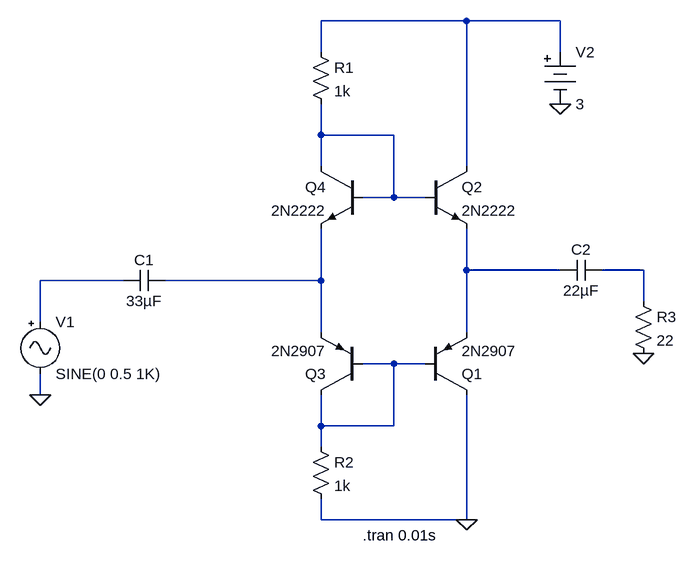
[diagram p0: schematic PowerAmp1.asc]
PowerAmp1.asc, the LTspice schematic file:
Version 4
SHEET 1 880 680
WIRE 96 -144 -128 -144
WIRE 240 -144 96 -144
WIRE -128 -96 -128 -144
WIRE 240 -96 240 -144
WIRE -128 32 -128 -16
WIRE -16 32 -128 32
WIRE -128 80 -128 32
WIRE 96 80 96 -144
WIRE -16 128 -16 32
WIRE -16 128 -64 128
WIRE 32 128 -16 128
WIRE 96 240 96 176
WIRE 240 240 96 240
WIRE 368 240 304 240
WIRE -432 256 -560 256
WIRE -128 256 -128 176
WIRE -128 256 -368 256
WIRE 368 288 368 240
WIRE -560 320 -560 256
WIRE -128 336 -128 256
WIRE 96 336 96 240
WIRE -16 384 -64 384
WIRE 32 384 -16 384
WIRE -560 432 -560 400
WIRE -128 480 -128 432
WIRE -16 480 -16 384
WIRE -16 480 -128 480
WIRE -128 512 -128 480
WIRE -128 624 -128 592
WIRE 96 624 96 432
WIRE 96 624 -128 624
FLAG 240 -16 0
FLAG -560 432 0
FLAG 368 368 0
FLAG 96 624 0
SYMBOL pnp 32 432 M180
SYMATTR InstName Q1
SYMATTR Value 2N2907
SYMBOL npn 32 80 R0
SYMATTR InstName Q2
SYMATTR Value 2N2222
SYMBOL signal -560 304 R0
SYMATTR InstName V1
SYMATTR Value SINE(0 0.5 1K)
SYMBOL battery 240 -112 R0
SYMATTR InstName V2
SYMATTR Value 3
SYMBOL pnp -64 432 R180
SYMATTR InstName Q3
SYMATTR Value 2N2907
SYMBOL npn -64 80 M0
SYMATTR InstName Q4
SYMATTR Value 2N2222
SYMBOL res -144 -112 R0
SYMATTR InstName R1
SYMATTR Value 1k
SYMBOL res -144 496 R0
SYMATTR InstName R2
SYMATTR Value 1k
SYMBOL res 352 272 R0
SYMATTR InstName R3
SYMATTR Value 22
SYMBOL cap -368 240 R90
WINDOW 0 0 32 VBottom 2
WINDOW 3 32 32 VTop 2
SYMATTR InstName C1
SYMATTR Value 33µF
SYMBOL cap 304 224 R90
WINDOW 0 0 32 VBottom 2
WINDOW 3 32 32 VTop 2
SYMATTR InstName C2
SYMATTR Value 22µF
TEXT -64 648 Left 2 !.tran 0.01s

The netlist it stands for:
* PowerAmp1.asc
Q1 0 N007 N003 0 2N2907
Q2 N001 N002 N003 0 2N2222
V1 N005 0 SINE(0 0.5 1K)
V2 N001 0 3
Q3 N007 N007 N006 0 2N2907
Q4 N002 N002 N006 0 2N2222
R1 N001 N002 1k
R2 N007 0 1k
R3 N004 0 22
C1 N006 N005 33µF
C2 N004 N003 22µF
.model NPN NPN
.model PNP PNP
.lib standard.bjt
.tran 0.01s
.backanno
.end